# Altium project FD-KL-ASM-SUB-PCBA-MAIN.PrjPcb (part 1 of 2)
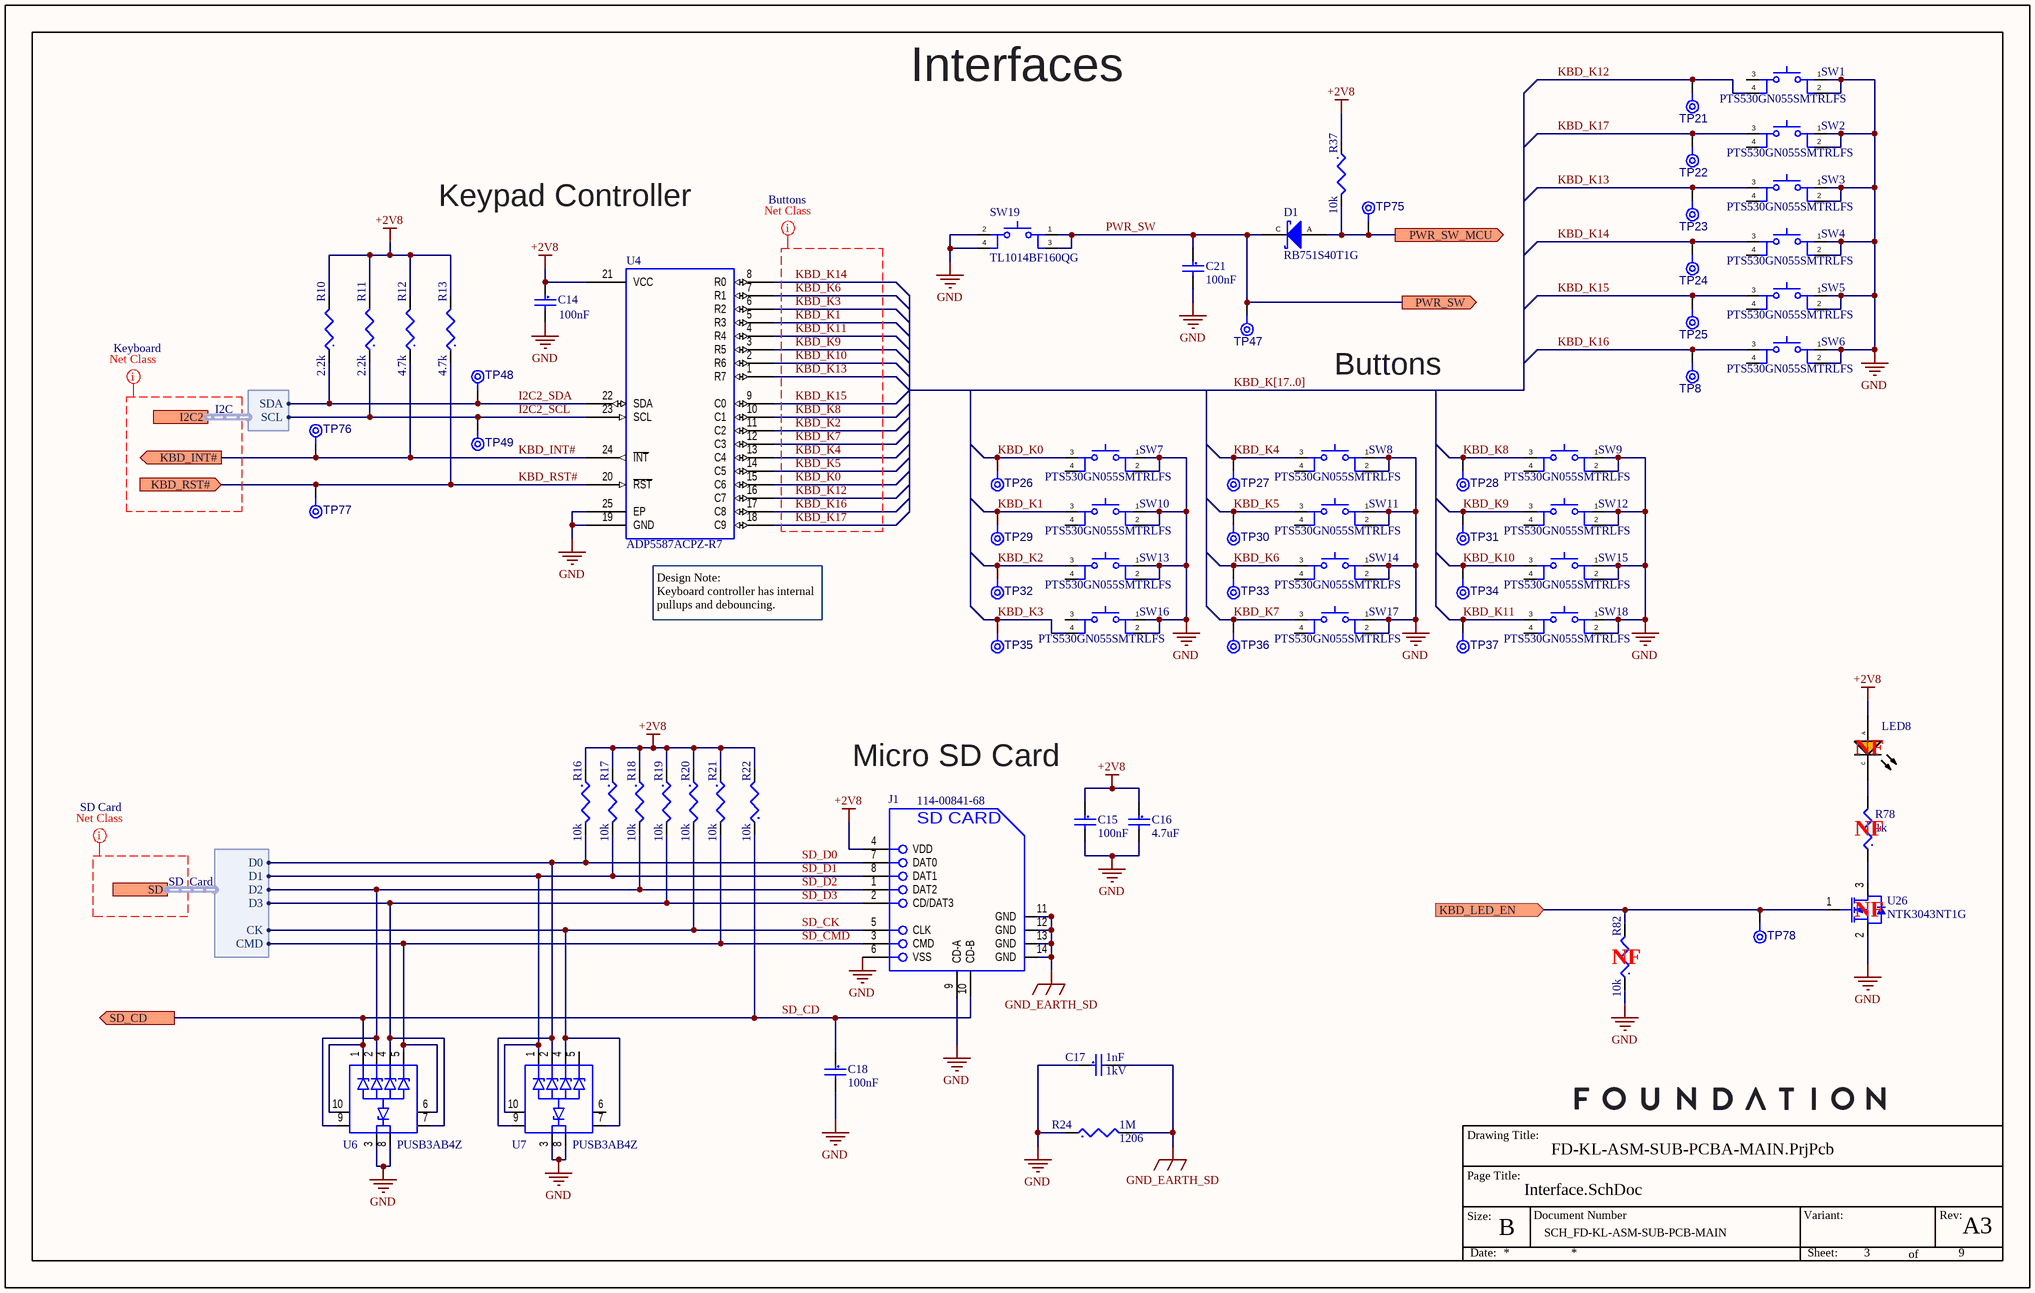
[diagram p0: Interface.SchDoc]
SCH_REV: A3; PCB_REV: A3; PCB_PART_NUMBER: FD-KL-ASM-SUB-PCB-MAIN; PCB_ENGINEER_APP_DATE: 12/11/2021; PCB_ENGINEER: M. Beach; PCB_DWG_NO: PCB-DWG_FD-KL-ASM-SUB-PCB-MAIN; PCB_DESIGNER_APP_DATE: 12/11/2021; PCB_DESIGNER: M. Beach; PCB_CHECKER_APP_DATE: 12/11/2021; PCB_CHECKER: M. Beach; PCB_ASSEMBLY_NO: PCB-ASSY_FD-KL-ASM-SUB-PCB-MAIN; PCB_ANG_TOL: +/-1/2; PCB_3_DEC_TOL: +/-.010; PCB_2_DEC_TOL: +/-.01; NotFitted: NF; DOC_NO_SCH_DWG: SCH_FD-KL-ASM-SUB-PCB-MAIN; DOC_NO_FAB_DWG: FAB_FD-KL-ASM-SUB-PCB-MAIN; DOC_NO_BOM: BOM_FD-KL-ASM-SUB-PCB-MAIN; DOC_NO_ASSY_DWG: ASSY_FD-KL-ASM-SUB-PCB-MAIN
5 sheets, 245 parts. Net scope: hierarchical (ports join the sheet entries above them; power ports are global).
Board file: FD-KL-ASM-SUB-PCBA-MAIN.PcbDoc
Sheets:
  Interface.SchDoc
  Camera.SchDoc
  LCD-Memory.SchDoc
  Power.SchDoc
  Charger.SchDoc

## Sheet Interface.SchDoc
size B; DocumentNumber: 3; SheetNumber: 3; SheetTotal: 9; ENG_APP_DATE: --/--/--; DSN_APP_DATE: --/--/--; CHK_APP_DATE: --/--/--

### Parts
C14  Capacitance: 100nF  [CAPC0402(1005)55_L]  (hidden comment: CAP CER 0.1uF 16V 10% X7R 0402)
C15  Capacitance: 100nF  [CAPC0402(1005)55_L]  (hidden comment: CAP CER 0.1uF 16V 10% X7R 0402)
C16  Capacitance: 4.7uF  [CAPC0402(1005)55_L]  (hidden comment: CAP CER 4.7UF 10V 20% X5R 0402)
C17  Capacitance: 1nF  Voltage Rating (DC): 1kV  [CAPC0805(2012)145_N]  (hidden comment: CAP CER 1000pF 1000V 10% X7R 0805)
C18  Capacitance: 100nF  [CAPC0402(1005)55_L]  (hidden comment: CAP CER 0.1uF 16V 10% X7R 0402)
C21  Capacitance: 100nF  [CAPC0402(1005)55_L]  (hidden comment: CAP CER 0.1uF 16V 10% X7R 0402)
D1  RB751S40T1G  [ON - SOD-523_V]
J1  114-00841-68  [AMPH - 114-00841-68_C-1]
LED8  IN-S63AT5A  [LEDC0603(1608)65_L]  (value not drawn)
R10  Resistance: 2.2k  [RESC0402(1005)_L]  (hidden comment: RES 2.2K 1/16W 1% 0402)
R11  Resistance: 2.2k  [RESC0402(1005)_L]  (hidden comment: RES 2.2K 1/16W 1% 0402)
R12  Resistance: 4.7k  [RESC0402(1005)_L]  (hidden comment: RES 4.7K 1/16W 1% 0402)
R13  Resistance: 4.7k  [RESC0402(1005)_L]  (hidden comment: RES 4.7K 1/16W 1% 0402)
R16  Resistance: 10k  [RESC0402(1005)_L]  (hidden comment: RES 10K 1/16W 1% 0402)
R17  Resistance: 10k  [RESC0402(1005)_L]  (hidden comment: RES 10K 1/16W 1% 0402)
R18  Resistance: 10k  [RESC0402(1005)_L]  (hidden comment: RES 10K 1/16W 1% 0402)
R19  Resistance: 10k  [RESC0402(1005)_L]  (hidden comment: RES 10K 1/16W 1% 0402)
R20  Resistance: 10k  [RESC0402(1005)_L]  (hidden comment: RES 10K 1/16W 1% 0402)
R21  Resistance: 10k  [RESC0402(1005)_L]  (hidden comment: RES 10K 1/16W 1% 0402)
R22  Resistance: 10k  [RESC0402(1005)_L]  (hidden comment: RES 10K 1/16W 1% 0402)
R24  Resistance: 1M  Case Code (Imperial): 1206  [RESC1206(3216)_L]  (hidden comment: RES 1.0M 1/4W 5% 1206)
R37  Resistance: 10k  [RESC0402(1005)_L]  (hidden comment: RES 10K 1/16W 1% 0402)
R78  Resistance: 1k  [RESC0402(1005)_L]  (hidden comment: RES 1.0K 1/16W 1% 0402)
R82  Resistance: 10k  [RESC0402(1005)_L]  (hidden comment: RES 10K 1/16W 1% 0402)
SW1  PTS530GN055SMTRLFS  [C&K - PTS530_V]
SW2  PTS530GN055SMTRLFS  [C&K - PTS530_V]
SW3  PTS530GN055SMTRLFS  [C&K - PTS530_V]
SW4  PTS530GN055SMTRLFS  [C&K - PTS530_V]
SW5  PTS530GN055SMTRLFS  [C&K - PTS530_V]
SW6  PTS530GN055SMTRLFS  [C&K - PTS530_V]
SW7  PTS530GN055SMTRLFS  [C&K - PTS530_V]
SW8  PTS530GN055SMTRLFS  [C&K - PTS530_V]
SW9  PTS530GN055SMTRLFS  [C&K - PTS530_V]
SW10  PTS530GN055SMTRLFS  [C&K - PTS530_V]
SW11  PTS530GN055SMTRLFS  [C&K - PTS530_V]
SW12  PTS530GN055SMTRLFS  [C&K - PTS530_V]
SW13  PTS530GN055SMTRLFS  [C&K - PTS530_V]
SW14  PTS530GN055SMTRLFS  [C&K - PTS530_V]
SW15  PTS530GN055SMTRLFS  [C&K - PTS530_V]
SW16  PTS530GN055SMTRLFS  [C&K - PTS530_V]
SW17  PTS530GN055SMTRLFS  [C&K - PTS530_V]
SW18  PTS530GN055SMTRLFS  [C&K - PTS530_V]
SW19  TL1014BF160QG  [E-SWITCH - TL1014BFXXXQG]
TP8  TPAD8R  [TP08R]  (value not drawn)  (no BOM)
TP21  TPAD8R  [TP08R]  (value not drawn)  (no BOM)
TP22  TPAD8R  [TP08R]  (value not drawn)  (no BOM)
TP23  TPAD8R  [TP08R]  (value not drawn)  (no BOM)
TP24  TPAD8R  [TP08R]  (value not drawn)  (no BOM)
TP25  TPAD8R  [TP08R]  (value not drawn)  (no BOM)
TP26  TPAD8R  [TP08R]  (value not drawn)  (no BOM)
TP27  TPAD8R  [TP08R]  (value not drawn)  (no BOM)
TP28  TPAD8R  [TP08R]  (value not drawn)  (no BOM)
TP29  TPAD8R  [TP08R]  (value not drawn)  (no BOM)
TP30  TPAD8R  [TP08R]  (value not drawn)  (no BOM)
TP31  TPAD8R  [TP08R]  (value not drawn)  (no BOM)
TP32  TPAD8R  [TP08R]  (value not drawn)  (no BOM)
TP33  TPAD8R  [TP08R]  (value not drawn)  (no BOM)
TP34  TPAD8R  [TP08R]  (value not drawn)  (no BOM)
TP35  TPAD8R  [TP08R]  (value not drawn)  (no BOM)
TP36  TPAD8R  [TP08R]  (value not drawn)  (no BOM)
TP37  TPAD8R  [TP08R]  (value not drawn)  (no BOM)
TP47  TPAD8R  [TP08R]  (value not drawn)  (no BOM)
TP48  TPAD8R  [TP08R]  (value not drawn)  (no BOM)
TP49  TPAD8R  [TP08R]  (value not drawn)  (no BOM)
TP75  TPAD8R  [TP08R]  (value not drawn)  (no BOM)
TP76  TPAD8R  [TP08R]  (value not drawn)  (no BOM)
TP77  TPAD8R  [TP08R]  (value not drawn)  (no BOM)
TP78  TPAD8R  [TP08R]  (value not drawn)  (no BOM)
U4  ADP5587ACPZ-R7  [ADEV - LFCSP-24_L]
U6  PUSB3AB4Z  [NEXP - DFN2510A-10_L]
U7  PUSB3AB4Z  [NEXP - DFN2510A-10_L]
U26  NTK3043NT1G  [SOT-723-3(40)_N]

### Ports
I2C2 (harness I2C), KBD_INT# (out), KBD_LED_EN (in), KBD_RST# (in), PWR_SW (out), PWR_SW_MCU (out), SD (harness SD_Card), SD_CD (out)

### Harnesses
SD_Card: CK, CMD, D0, D1, D2, D3
I2C: SCL, SDA

### Nets
+2V8: C14.1 C15.1 C16.1 J1.4(VDD) LED8.A R10.2 R11.2 R12.2 R13.2 R16.1 R17.1 R18.1 R19.1 R20.1 R21.1 R22.2 R37.1 U4.21(VCC)
GND: C14.2 C15.2 C16.2 C17.1 C18.2 C21.2 J1.6(VSS) J1.9(CD-A) R24.1 R82.1 SW1.1 SW1.2 SW2.1 SW2.2 SW3.1 SW3.2 SW4.1 SW4.2 SW5.1 SW5.2 SW6.1 SW6.2 SW7.1 SW7.2 SW8.1 SW8.2 SW9.1 SW9.2 SW10.1 SW10.2 SW11.1 SW11.2 SW12.1 SW12.2 SW13.1 SW13.2 SW14.1 SW14.2 SW15.1 SW15.2 SW16.1 SW16.2 SW17.1 SW17.2 SW18.1 SW18.2 SW19.2 SW19.4 U4.19(GND) U4.25(EP) U6.3(DIODE) U6.8(DIODE) U7.3(DIODE) U7.8(DIODE) U26.2(S)
GND_EARTH_SD: C17.2 J1.11(GND) J1.12(GND) J1.13(GND) J1.14(GND) R24.2
I2C2_SCL: R11.1 TP49.1(TP) U4.23(SCL) ; port I2C2.SCL
I2C2_SDA: R10.1 TP48.1(TP) U4.22(SDA) ; port I2C2.SDA
KBD_INT#: R12.1 TP76.1(TP) U4.24(~{INT}) ; port KBD_INT#
KBD_K0: SW7.3 TP26.1(TP) U4.15(C6)
KBD_K1: SW10.3 TP29.1(TP) U4.5(R3)
KBD_K2: SW13.3 TP32.1(TP) U4.11(C2)
KBD_K3: SW16.4 TP35.1(TP) U4.6(R2)
KBD_K4: SW8.3 TP27.1(TP) U4.13(C4)
KBD_K5: SW11.3 TP30.1(TP) U4.14(C5)
KBD_K6: SW14.3 TP33.1(TP) U4.7(R1)
KBD_K7: SW17.3 TP36.1(TP) U4.12(C3)
KBD_K8: SW9.3 TP28.1(TP) U4.10(C1)
KBD_K9: SW12.3 TP31.1(TP) U4.3(R5)
KBD_K10: SW15.3 TP34.1(TP) U4.2(R6)
KBD_K11: SW18.3 TP37.1(TP) U4.4(R4)
KBD_K12: SW1.4 TP21.1(TP) U4.16(C7)
KBD_K13: SW3.3 TP23.1(TP) U4.1(R7)
KBD_K14: SW4.3 TP24.1(TP) U4.8(R0)
KBD_K15: SW5.3 TP25.1(TP) U4.9(C0)
KBD_K16: SW6.3 TP8.1(TP) U4.17(C8)
KBD_K17: SW2.3 TP22.1(TP) U4.18(C9)
KBD_RST#: R13.1 TP77.1(TP) U4.20(~{RST}) ; port KBD_RST#
PWR_SW: C21.1 D1.C SW19.1 SW19.3 TP47.1(TP) ; port PWR_SW
SD_CD: C18.1 J1.10(CD-B) R22.1 U6.1(DIODE) U6.10(DIODE) ; port SD_CD
SD_CK: J1.5(CLK) R20.2 U7.4(DIODE) U7.7(DIODE) ; port SD.CK
SD_CMD: J1.3(CMD) R21.2 U6.5(DIODE) U6.6(DIODE) ; port SD.CMD
SD_D0: J1.7(DAT0) R16.2 U7.2(A) U7.9(DIODE) ; port SD.D0
SD_D1: J1.8(DAT1) R17.2 U7.1(DIODE) U7.10(DIODE) ; port SD.D1
SD_D2: J1.1(DAT2) R18.2 U6.2(A) U6.9(DIODE) ; port SD.D2
SD_D3: J1.2(CD/DAT3) R19.2 U6.4(DIODE) U6.7(DIODE) ; port SD.D3
NetD1_A: D1.A R37.2 TP75.1(TP) ; port PWR_SW_MCU
NetLED8_C: LED8.C R78.2
NetR78_1: R78.1 U26.3(D)
NetR82_2: R82.2 TP78.1(TP) U26.1(G) ; port KBD_LED_EN

Not connected (* = marked no-connect by the designer): SW1 3; SW2 4; SW3 4; SW4 4; SW5 4; SW6 4; SW7 4; SW8 4; SW9 4; SW10 4; SW11 4; SW12 4; SW13 4; SW14 4; SW15 4; SW16 3; SW17 4; SW18 4; U7 5(DIODE) 6(DIODE)

### Buses and harness runs
bus KBD_K[17..0]

### Layout directives
net class Keyboard: (no net found under the mark)
net class SD Card: (no net found under the mark)
net class Buttons: KBD_K0, KBD_K1, KBD_K2, KBD_K3, KBD_K4, KBD_K5, KBD_K6, KBD_K7, KBD_K8, KBD_K9, KBD_K10, KBD_K11, KBD_K12, KBD_K13, KBD_K14, KBD_K15, KBD_K16, KBD_K17

### Notes on the sheet
- Interfaces
- Keypad Controller
- Buttons
- (near U4) Design Note:
  Keyboard controller has internal pullups and debouncing.
- Micro SD Card
- Drawing Title:
- Page Title:
- Size:
- B
- Document Number
- Variant:
- Rev:
- Date:
- Sheet:
- of
- (in symbol CMP-CON-0078-2) SD CARD

### Library data of the parts
C14 C15 C18 C21 = CMP-CAP-00002-2: 0.1µF ±10% 16V Ceramic Capacitor X7R 0402 (1005 Metric); Insulation Resistance: 10GR; Material: Ceramic; Tolerance: 10%; REACH SVHC: No SVHC; Radiation Hardening: No; Case Code (Metric): 1005; Height: 0.5mm; Depth: 0.5mm; Min Operating Temperature: -55°C; Max Operating Temperature: 125°C; Lead Free: Lead Free; Thickness: 0.022inch; Length: 1mm; Voltage Rating (DC): 16V; Dielectric Material: Ceramic; Packaging: Tape and Reel; Case/Package: 0402; Width: 0.5mm; Termination: SMD/SMT; Voltage Rating: 16V; Mount: Surface Mount; Case Code (Imperial): 0402; Package Quantity: 1; Dielectric: X7R; Number of Pins: 2; Voltage: 16V
C16 = CMP-CAP-00038-1: 4.7µF ±20% 10V Ceramic Capacitor X5R 0402 (1005 Metric); Length: 1mm; Termination: SMD/SMT; Max Operating Temperature: 85°C; Case Code (Imperial): 0402; Height: 0.5mm; Voltage Rating: 10V; Composition: Ceramic; Dielectric: X5R; Voltage Rating (DC): 10V; REACH SVHC: No SVHC; Case Code (Metric): 1005; Tolerance: 20%; Case/Package: 0402; Min Operating Temperature: -55°C; Width: 0.02inch; Mount: Surface Mount; Packaging: Tape and Reel; Package Quantity: 1; Thickness: 500um; Radiation Hardening: No; Voltage: 10V; Depth: 0.5mm; Weight: 2.3E-05oz; Dielectric Material: Ceramic; Lead Free: Lead Free
C17 = CMP-CAP-00004-1: 1000pF ±10% 1000V (1kV) Ceramic Capacitor X7R 0805 (2012 Metric); Insulation Resistance: 100GR; Mount: Surface Mount; Width: 1.25mm; Voltage Rating: 1kV; Number of Pins: 2; Packaging: Tape and Reel; Package Quantity: 4000; Termination: SMD/SMT; Height: 1.3mm; Case Code (Metric): 2012; Depth: 1.25mm; Dielectric: X7R; Thickness: 0.051inch; Length: 2.01mm; Case Code (Imperial): 0805; Contact Plating: Nickel,Tin,Matte; Dissipation Factor: 10%; Tolerance: 10%; Case/Package: 0805; Min Operating Temperature: -55°C; REACH SVHC: No SVHC; Lead Free: Lead Free; Dielectric Material: Ceramic; Max Operating Temperature: 125°C
D1 = CMP-DIO-0007-1: Diode Schottky 30V 30mA (DC) Surface Mount SOD-523; Voltage Rating (DC): 40V; Peak Non-Repetitive Surge Current: 500mA; Peak Reverse Current: 500nA; Element Configuration: Single; Capacitance: 2.5pF; Power Dissipation: 200mW; Polarity: Standard; Forward Voltage: 370mV; Radiation Hardening: No; Min Operating Temperature: -55°C; Current Rating: 30mA; Forward Current: 30mA; Number of Pins: 2; Average Rectified Current: 30mA; Output Current: 30mA; Max Operating Temperature: 150°C; Width: 0.9mm; ComponentLink1Description: Datasheet; Length: 1.3mm; Max Surge Current: 500mA; Max Reverse Voltage (DC): 30V; REACH SVHC: No SVHC; Lead Free: Lead Free; Max Reverse Leakage Current: 500nA; Max Forward Surge Current (Ifsm): 500mA; Package Quantity: 1; ComponentLink1URL: https://www.onsemi.cn/PowerSolutions/document/RB751S40T1-D.PDF; Max Repetitive Reverse Voltage (Vrrm): 40V; Contact Plating: Tin,Matte; Case/Package: SOD-523-2; Height: 0.7mm; Packaging: Tape and Reel
J1 = CMP-CON-0078-2: 10 (8 + 2) Position Card Connector Secure Digital - microSD™ Surface Mount, Right Angle Gold; ComponentLink1URL: https://media.digikey.com/pdf/Data%20Sheets/Amphenol%20PDFs/114-00841-68.pdf; ComponentLink1Description: Drawing
LED8 = CMP-007-00047-1: Amber 605nm LED Indication - Discrete 1.9V 0603 (1608 Metric); Forward Voltage: 1.9V; Colour: Amber; ComponentLink1Description: Datasheet; ComponentLink1URL: http://www.inolux-corp.com/datasheet/SMDLED/Mono%20Color%20Top%20View/IN-S63AT%20Series_V1.1.pdf
R10 R11 = CMP-RES-00049-1: 2.2 kOhms ±1% 0.063W, 1/16W Chip Resistor 0402 (1005 Metric); Power Rating: 63mW; Temperature Coefficient: 100ppm/°C; Voltage Rating: 50V; Weight: 2.3E-05oz; Military Standard: Not; Termination: SMD/SMT; Max Operating Temperature: 155°C; Case Code (Metric): 1005; Case Code (Imperial): 0402; REACH SVHC: Unknown; Min Operating Temperature: -55°C; Tolerance: 1%; Width: 0.5mm; Depth: 0.5mm; Length: 1mm; Case/Package: 0402; Height: 0.35mm; Packaging: Tape and Reel; Lead Free: Lead Free; Composition: Thick Film
R12 R13 = CMP-RES-00002-3: 4.7 kOhms ±1% 0.063W, 1/16W Chip Resistor 0402 (1005 Metric) Automotive AEC-Q200 Thick Film; Max Power Dissipation: 63mW; Voltage Rating (DC): 50V; Temperature Coefficient: 100ppm/°C; Weight: 2.3E-05oz; Package Quantity: 10; Military Standard: Not; Contact Plating: Tin; Termination: SMD/SMT; Max Operating Temperature: 155°C; Case Code (Metric): 1005; Case Code (Imperial): 0402; Features: Automotive AEC-Q200; Power Rating: 63mW; REACH SVHC: Unknown; Min Operating Temperature: -55°C; Tolerance: 1%; Mount: Surface Mount; Width: 0.5mm; Depth: 0.5mm; Radiation Hardening: No; Length: 1mm; Number of Terminations: 2; Case/Package: 0402; Voltage Rating: 50V; Height: 0.35mm; Packaging: Tape and Reel; Lead Free: Lead Free; Composition: Thick Film
R16-R21 R37 = CMP-RES-00006-3: 10 kOhms ±1% 0.063W, 1/16W Chip Resistor 0402 (1005 Metric); Voltage Rating (DC): 50V; Power Rating: 63mW; Temperature Coefficient: 100ppm/°C; Case Code (Imperial): 0402; Mount: Surface Mount; Composition: Thick Film; Features: Automotive AEC-Q200; Depth: 0.5mm; Height: 0.35mm; Weight: 2.3E-05oz; Number of Pins: 2; Termination: SMD/SMT; Min Operating Temperature: -55°C; Length: 1mm; Package Quantity: 10; Lead Free: Lead Free; Radiation Hardening: No; Max Operating Temperature: 155°C; Voltage Rating: 50V; Military Standard: Not; Case/Package: 0402; Contact Plating: Tin; Max Power Dissipation: 63mW; Tolerance: 1%; Case Code (Metric): 1005; Number of Terminations: 2; Packaging: Tape and Reel; REACH SVHC: Unknown; Width: 0.02inch
R22 R82 = CMP-RES-00006-3: 10 kOhms ±1% 0.063W, 1/16W Chip Resistor 0402 (1005 Metric); Max Power Dissipation: 63mW; Voltage Rating (DC): 50V; Temperature Coefficient: 100ppm/°C; Width: 0.02inch; Power Rating: 63mW; Case/Package: 0402; Min Operating Temperature: -55°C; Number of Terminations: 2; Lead Free: Lead Free; Features: Automotive AEC-Q200; Number of Pins: 2; Tolerance: 1%; Height: 0.35mm; Mount: Surface Mount; Radiation Hardening: No; Length: 1mm; Case Code (Metric): 1005; Weight: 2.3E-05oz; Military Standard: Not; Depth: 0.5mm; Package Quantity: 10; Max Operating Temperature: 155°C; Termination: SMD/SMT; Case Code (Imperial): 0402; Contact Plating: Tin; Voltage Rating: 50V; Composition: Thick Film; Packaging: Tape and Reel; REACH SVHC: Unknown
R24 = CMP-RES-00004-3: 1 MOhms ±5% 0.25W, 1/4W Chip Resistor 1206 (3216 Metric) Moisture Resistant Thick Film; Power Rating: 250mW; Temperature Coefficient: 200ppm/°C; Voltage Rating: 200V; Mount: Surface Mount; Radiation Hardening: No; Tolerance: 5%; Military Standard: Not; Termination: SMD/SMT; Case Code (Metric): 3216; Depth: 1.6mm; Case/Package: 1206; REACH SVHC: No SVHC; Height: 0.6mm; Max Operating Temperature: 155°C; Package Quantity: 5000; Thickness: 610um; Min Operating Temperature: -55°C; Voltage Rating (DC): 200V; Length: 3.2mm; Composition: Thick Film; Width: 1.6mm; Packaging: Tape and Reel; Contact Plating: Tin
R78 = CMP-RES-00000-3: 1 kOhms ±0.5% 0.063W, 1/16W Chip Resistor 0402 (1005 Metric) Automotive AEC-Q200 Thin Film; Max Power Dissipation: 63mW; Power Rating: 62.5mW; Voltage Rating (DC): 25V; Temperature Coefficient: 25ppm/°C; Width: 0.5mm; Case/Package: 0402; Min Operating Temperature: -55°C; Number of Terminations: 2; Lead Free: Lead Free; Tolerance: 0.5%; Height: 0.016inch; Mount: Surface Mount; Radiation Hardening: No; Length: 1mm; Case Code (Metric): 1005; Weight: 2.8E-05oz; Military Standard: Not; Depth: 0.5mm; Package Quantity: 10000; Max Operating Temperature: 155°C; Termination: SMD/SMT; Case Code (Imperial): 0402; Contact Plating: Tin; Voltage Rating: 25V; Composition: Metal Film,Thin Film; Packaging: Tape and Reel; REACH SVHC: No SVHC
SW1-SW18 = CMP-SWH-00003-1: Tactile Switch SPST-NO Top Actuated Surface Mount; Manufacturer Series: PTS530; Contact DC Max Rating R Load: 0.05A@12VDC; Dielectric Withstand Volts: 250VACV; Body Height: 0.5588mm; Switch Action: MOMENTARY; Contact Voltage(DC)-Max: 12V; Actuator Travel: 0.2032mm; Electrical Life: 1000000Cycles; Body Length or Diameter: 4.4958mm; Switch Type: Keypad; Contact Current(DC)-Max: 50mA; Actuator Type: Pushbutton; Contact Resistance: 0.05mR; Insulation Resistance: 100MR; Body Breadth: 4.4958inch; Switch Function: SPST; Min Operating Temperature: -40°C; Max Operating Temperature: 85°C; RoHS Compliant: Yes; Mount: Surface Mount; ComponentLink1URL: https://www.ckswitches.com/media/1469/pts530.pdf; Termination: Solder; ComponentLink1Description: Datasheet; REACH SVHC: Yes; JESD-609 Code: e4; Terminal Finish: Silver
SW19 = CMP-SWH-00004-1: Tactile Switch SPST-NO Side Actuated Surface Mount, Right Angle; Switch Type: Keypad; ComponentLink1Description: Drawing; ComponentLink1URL: http://spec_sheets.e-switch.com/specs/P410002.pdf; JESD-609 Code: e4; REACH SVHC: Yes; Terminal Finish: Silver; RoHS Compliant: Yes
TP8 TP21-TP37 TP47-TP49 TP75-TP78 = CMP-MECH-00011-2: 0.8mm round; Pins: 1
U4 = CMP-IC-INT-0000-10: I/O Expander 18 I²C 400kHz 24-LFCSP-WQ (4x4); Max Supply Voltage: 3.6V; Number of I/Os: 18; Nominal Supply Current: 200uA; Min Supply Voltage: 1.65V; Interface: I2C; Number of Pins: 24; REACH SVHC: No SVHC; Case/Package: 24-LFCSP-WQ (4x4); Max Operating Temperature: 85°C; Package Quantity: 1500; Min Operating Temperature: -40°C; Frequency: 400kHz; Packaging: Tape and Reel; Mount: Surface Mount; Lead Free: Contains Lead; Max Frequency: 400kHz; ComponentLink1URL: https://www.analog.com/media/en/technical-documentation/data-sheets/ADP5587.pdf; ComponentLink1Description: Datasheet; Max Supply Current: 200uA
U6 U7 = CMP-DIO-0006-4: TVS DIODE 3.3V 5V DFN2510A-10; Capacitance @ Frequency: 0.17pF @ 1MHz; Bidirectional Channels: 4; Type: Zener; Max Operating Temperature: 85°C; Min Operating Temperature: -40°C; Case/Package: DFN2510A-10; ComponentLink1Description: Datasheet; ComponentLink1URL: https://assets.nexperia.com/documents/data-sheet/PUSB3AB4.pdf
U26 = CMP-TRNST-0003-1: N-Channel 20V 210mA (Ta) 310mW (Ta) Surface Mount SOT-723; Power Dissipation: 440mW; Gate to Source Voltage (Vgs): 10V; Drain to Source Resistance: 3.4R; Input Capacitance: 11pF; Turn-On Delay Time: 13ns; Vgs(th) (Max) @ Id: 1.3V @ 250µA; Turn-Off Delay Time: 94ns; Rise Time: 15ns; Number of Elements: 1; Element Configuration: Single; Current Rating: 225mA; Threshold Voltage: 400mV; Max Operating Temperature: 150°C; Package Quantity: 1; Packaging: Tape and Reel; Continuous Drain Current (ID): 210mA; Pins: 3; Min Operating Temperature: -55°C; Vgs (Max): 10V; Drain to Source Breakdown Voltage: 20V; Radiation Hardening: No; Mounting Technology: Surface Mount; Drain to Source Voltage (Vdss): 20V; Number of Pins: 3; Max Power Dissipation: 310mW; Fall Time: 15ns; Case/Package: SOT-723-3; Transistor Type: N-Channel; Rds On Max: 3.4R; Lead Free: Lead Free; Height: 0.55mm; Contact Plating: Tin,Matte; On-State Resistance: 3.4R; Length: 1.25mm; REACH SVHC: No SVHC; Width: 0.85mm; Voltage Rating (DC): 20V

## Sheet Camera.SchDoc
size B; DocumentNumber: 4; SheetNumber: 4; SheetTotal: 9; ENG_APP_DATE: --/--/--; DSN_APP_DATE: --/--/--; CHK_APP_DATE: --/--/--
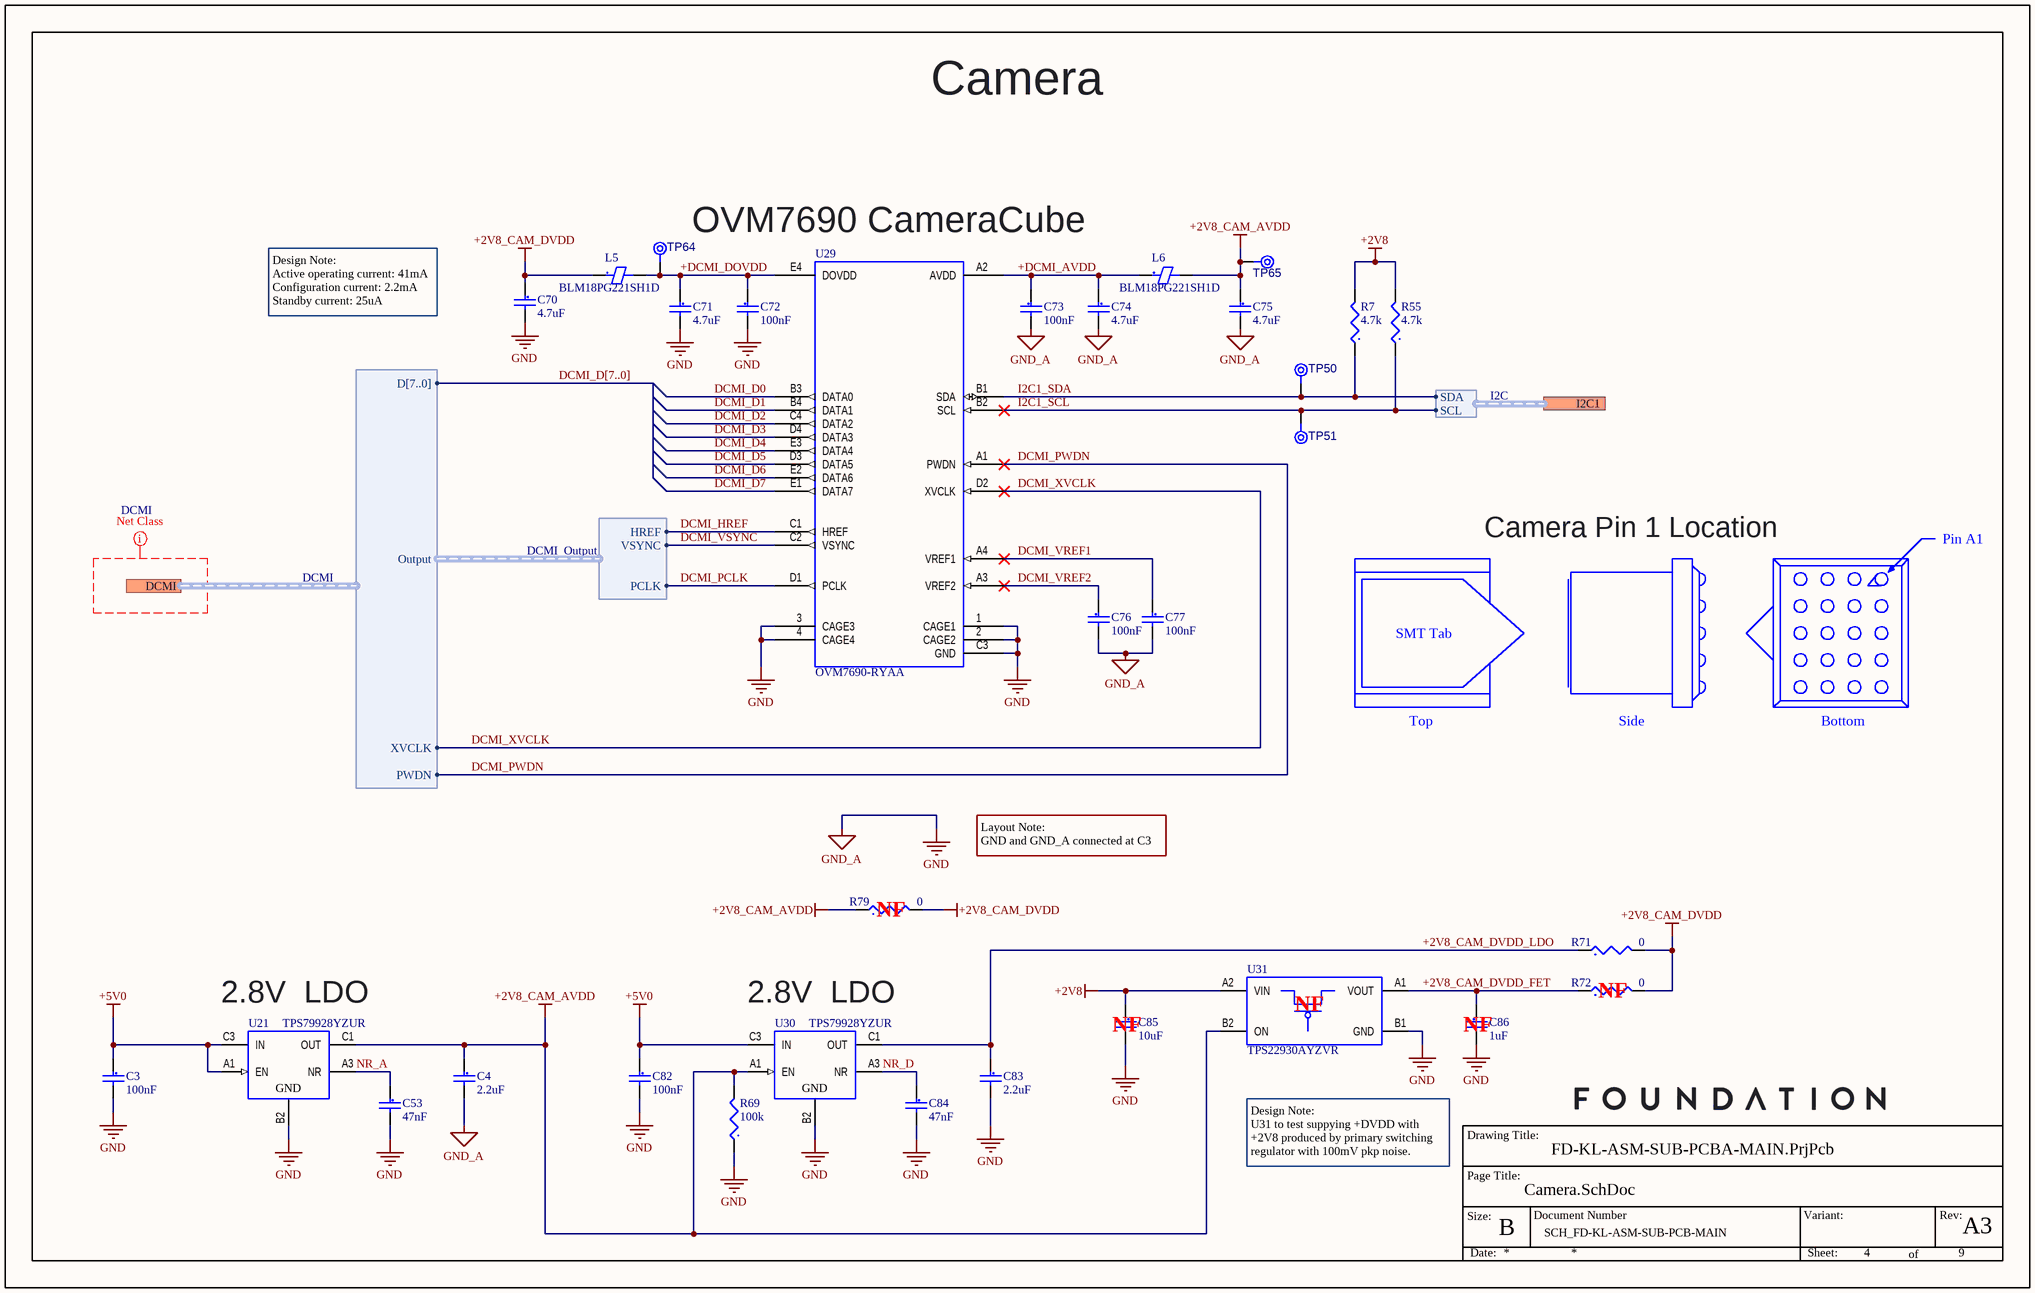
[diagram p1: Camera.SchDoc]

### Parts
C3  Capacitance: 100nF  [CAPC0402(1005)55_L]  (hidden comment: CAP CER 0.1uF 16V 10% X7R 0402)
C4  Capacitance: 2.2uF  [CAPC0402(1005)55_L]  (hidden comment: CAP CER 2.2uF 6.3V 10% X5R 0402)
C53  Capacitance: 47nF  [CAPC0402(1005)55_L]  (hidden comment: CAP CER 0.047uF 10V 10% X7R 0402)
C70  Capacitance: 4.7uF  [CAPC0402(1005)55_L]  (hidden comment: CAP CER 4.7UF 10V 20% X5R 0402)
C71  Capacitance: 4.7uF  [CAPC0402(1005)55_L]  (hidden comment: CAP CER 4.7UF 10V 20% X5R 0402)
C72  Capacitance: 100nF  [CAPC0402(1005)55_L]  (hidden comment: CAP CER 0.1uF 16V 10% X7R 0402)
C73  Capacitance: 100nF  [CAPC0402(1005)55_L]  (hidden comment: CAP CER 0.1uF 16V 10% X7R 0402)
C74  Capacitance: 4.7uF  [CAPC0402(1005)55_L]  (hidden comment: CAP CER 4.7UF 10V 20% X5R 0402)
C75  Capacitance: 4.7uF  [CAPC0402(1005)55_L]  (hidden comment: CAP CER 4.7UF 10V 20% X5R 0402)
C76  Capacitance: 100nF  [CAPC0402(1005)55_L]  (hidden comment: CAP CER 0.1uF 16V 10% X7R 0402)
C77  Capacitance: 100nF  [CAPC0402(1005)55_L]  (hidden comment: CAP CER 0.1uF 16V 10% X7R 0402)
C82  Capacitance: 100nF  [CAPC0402(1005)55_L]  (hidden comment: CAP CER 0.1uF 16V 10% X7R 0402)
C83  Capacitance: 2.2uF  [CAPC0402(1005)55_L]  (hidden comment: CAP CER 2.2uF 6.3V 10% X5R 0402)
C84  Capacitance: 47nF  [CAPC0402(1005)55_L]  (hidden comment: CAP CER 0.047uF 10V 10% X7R 0402)
C85  Capacitance: 10uF  [CAPC0402(1005)55_L]  (hidden comment: CAP CER 10uF 10V 20% X5R 0402)
C86  Capacitance: 1uF  [CAPC0402(1005)55_L]  (hidden comment: CAP CER 1uF 25V 10% X5R 0402)
L5  BLM18PG221SH1D  [FBC0603(1608)90_L]
L6  BLM18PG221SH1D  [FBC0603(1608)90_L]
R7  Resistance: 4.7k  [RESC0402(1005)_L]  (hidden comment: RES 4.7K 1/16W 1% 0402)
R55  Resistance: 4.7k  [RESC0402(1005)_L]  (hidden comment: RES 4.7K 1/16W 1% 0402)
R69  Resistance: 100k  [RESC0402(1005)_L]  (hidden comment: RES 100K 1/16W 1% 0402)
R71  Resistance: 0  [RESC0603(1608)_L]  (hidden comment: RES 0 OHM JUMPER 1/10W 0603)
R72  Resistance: 0  [RESC0603(1608)_L]  (hidden comment: RES 0 OHM JUMPER 1/10W 0603)
R79  Resistance: 0  [RESC0603(1608)_L]  (hidden comment: RES 0 OHM JUMPER 1/10W 0603)
TP50  TPAD8R  [TP08R]  (value not drawn)  (no BOM)
TP51  TPAD8R  [TP08R]  (value not drawn)  (no BOM)
TP64  TPAD8R  [TP08R]  (value not drawn)  (no BOM)
TP65  TPAD8R  [TP08R]  (value not drawn)  (no BOM)
U21  TPS79928YZUR  [TI - DSBGA-YZU-5_V]
U29  OVM7690-RYAA  [OMNI - CCBGA-CG-20]
U30  TPS79928YZUR  [TI - DSBGA-YZU-5_V]
U31  TPS22930AYZVR  [TI - DSBGA-YZV-4_V]

### Ports
DCMI (harness DCMI), I2C1 (harness I2C)

### Harnesses
I2C: SCL, SDA
DCMI: Output, D[7..0], XVCLK, PWDN
DCMI_Output: HREF, VSYNC, PCLK

### Nets
+2V8: C85.1 R7.2 R55.2 U31.A2(VIN)
+2V8_CAM_AVDD: C4.1 C75.1 L6.2 R69.2 R79.1 TP65.1(TP) U21.C1(OUT) U30.A1(EN) U31.B2(ON)
+2V8_CAM_DVDD: C70.1 L5.1 R71.2 R72.2 R79.2
+5V0: C3.1 C82.1 U21.A1(EN) U21.C3(IN) U30.C3(IN)
GND: C3.2 C4.2 C53.2 C70.2 C71.2 C72.2 C73.2 C74.2 C75.2 C76.2 C77.2 C82.2 C83.2 C84.2 C85.2 C86.2 R69.1 U21.B2(GND) U29.1(CAGE1) U29.2(CAGE2) U29.3(CAGE3) U29.4(CAGE4) U29.C3(GND) U30.B2(GND) U31.B1(GND)  [also labelled GND_A]
+2V8_CAM_DVDD_FET: C86.1 R72.1 U31.A1(VOUT)
+2V8_CAM_DVDD_LDO: C83.1 R71.1 U30.C1(OUT)
+DCMI_AVDD: C73.1 C74.1 L6.1 U29.A2(AVDD)
+DCMI_DOVDD: C71.1 C72.1 L5.2 TP64.1(TP) U29.E4(DOVDD)
DCMI_D0: U29.B3(DATA0)
DCMI_D1: U29.B4(DATA1)
DCMI_D2: U29.C4(DATA2)
DCMI_D3: U29.D4(DATA3)
DCMI_D4: U29.E3(DATA4)
DCMI_D5: U29.D3(DATA5)
DCMI_D6: U29.E2(DATA6)
DCMI_D7: U29.E1(DATA7)
DCMI_HREF: U29.C1(HREF) ; harness DCMI_Output.HREF
DCMI_PCLK: U29.D1(PCLK) ; harness DCMI_Output.PCLK
DCMI_PWDN: U29.A1(PWDN) ; port DCMI.PWDN
DCMI_VREF1: C77.1 U29.A4(VREF1)
DCMI_VREF2: C76.1 U29.A3(VREF2)
DCMI_VSYNC: U29.C2(VSYNC) ; harness DCMI_Output.VSYNC
DCMI_XVCLK: U29.D2(XVCLK) ; port DCMI.XVCLK
I2C1_SCL: R55.1 TP51.1(TP) U29.B2(SCL) ; port I2C1.SCL
I2C1_SDA: R7.1 TP50.1(TP) U29.B1(SDA) ; port I2C1.SDA
NR_A: C53.1 U21.A3(NR)
NR_D: C84.1 U30.A3(NR)

### Buses and harness runs
bus DCMI_D[7..0]

### Layout directives
net class DCMI: (no net found under the mark)

### Notes on the sheet
- Camera
- (near U29) OVM7690 CameraCube
- Design Note:
  Active operating current: 41mA
  Configuration current: 2.2mA
  Standby current: 25uA
- Camera Pin 1 Location
- Pin A1
- SMT Tab
- Top
- Side
- Bottom
- Layout Note:
  GND and GND_A connected at C3
- (near U21) 2.8V  LDO
- (near U30) 2.8V  LDO
- Design Note:
  U31 to test suppying +DVDD with +2V8 produced by primary switching regulator with 100mV pkp noise.
- Drawing Title:
- Page Title:
- Size:
- B
- Document Number
- Variant:
- Rev:
- Date:
- Sheet:
- of

### Library data of the parts
C3 C72 C73 C76 C77 C82 = CMP-CAP-00002-2: as C14 on sheet Interface; Material: Ceramic; Tolerance: 10%; REACH SVHC: No SVHC; Radiation Hardening: No; Case Code (Metric): 1005; Height: 0.5mm; Depth: 0.5mm; Min Operating Temperature: -55°C; Max Operating Temperature: 125°C; Lead Free: Lead Free; Thickness: 0.022inch; Length: 1mm; Voltage Rating (DC): 16V; Dielectric Material: Ceramic; Packaging: Tape and Reel; Case/Package: 0402; Width: 0.5mm; Termination: SMD/SMT; Voltage Rating: 16V; Mount: Surface Mount; Case Code (Imperial): 0402; Package Quantity: 1; Dielectric: X7R; Number of Pins: 2; Voltage: 16V
C4 C83 = CMP-CAP-00042-1: 2.2µF ±10% 6.3V Ceramic Capacitor X5R 0402 (1005 Metric); Lead Free: Lead Free; Tolerance: 10%; Width: 0.02inch; Number of Pins: 2; Contact Plating: Tin,Matte; Max Operating Temperature: 85°C; Termination: SMD/SMT; Voltage Rating: 6.3V; Thickness: 0.022inch; Case Code (Imperial): 0402; Case Code (Metric): 1005; Radiation Hardening: No; Package Quantity: 1; Mount: Surface Mount; Length: 1mm; Case/Package: 0402; REACH SVHC: No SVHC; Packaging: Tape and Reel; Min Operating Temperature: -55°C; Dielectric: X5R; Depth: 0.5mm; Voltage Rating (DC): 6.3V
C53 C84 = CMP-CAP-00056-1: 0.047µF ±10% 10V Ceramic Capacitor X7R 0402 (1005 Metric); Number of Terminals/Pins: 2; Multilayer: Yes; Height: 0.5mm; Package Shape: Rectangular; Positive Tolerance: 10%; Max Operating Temperature: 125°C; Termination: Wraparound; Capacitor Type: Ceramic; Width: 0.5mm; Negative Tolerance: 10%; Rated DC Voltage (URdc): 10V; Length: 1mm; Mount: Surface Mount; Size Code: 0402; JESD-609 Code: e3; Temperature Characteristics Code: X7R; Min Operating Temperature: -55°C; Terminal Finish: Nickel; Package Style: SMTMeter; Packaging: Tape and Reel; Dielectric Material: Ceramic
C70 C71 C74 C75 = CMP-CAP-00038-1: as C16 on sheet Interface; Length: 1mm; Termination: SMD/SMT; Max Operating Temperature: 85°C; Case Code (Imperial): 0402; Height: 0.5mm; Voltage Rating: 10V; Composition: Ceramic; Dielectric: X5R; Voltage Rating (DC): 10V; REACH SVHC: No SVHC; Case Code (Metric): 1005; Tolerance: 20%; Case/Package: 0402; Min Operating Temperature: -55°C; Width: 0.02inch; Mount: Surface Mount; Packaging: Tape and Reel; Package Quantity: 1; Thickness: 500um; Radiation Hardening: No; Voltage: 10V; Depth: 0.5mm; Weight: 2.3E-05oz; Dielectric Material: Ceramic; Lead Free: Lead Free
C85 = CMP-CAP-00007-2: 10µF ±20% 10V Ceramic Capacitor X5R 0402 (1005 Metric); Radiation Hardening: No; Mount: Surface Mount; Voltage Rating: 10V; Contact Plating: Tin; Length: 1mm; Lead Free: Lead Free; Dielectric: X5R; Packaging: Tape and Reel; Depth: 0.5mm; Case Code (Imperial): 0402; Termination: Wraparound; Min Operating Temperature: -55°C; Package Quantity: 1; Case Code (Metric): 1005; Width: 0.02inch; Thickness: 0.028inch; Tolerance: 20%; Case/Package: 0402; Max Operating Temperature: 85°C
C86 = CMP-CAP-00053-2: 1uF ±10% 25V Ceramic Capacitor X5R 0402 (1005 Metric); Number of Terminals/Pins: 2; Multilayer: Yes; Mount: Surface Mount; Length: 1mm; Packaging: Tape and Reel; Termination: Wraparound; Min Operating Temperature: -55°C; Width: 0.5mm; Capacitor Type: Ceramic; Max Operating Temperature: 85°C; Height: 0.6mm; Dielectric Material: Ceramic; Negative Tolerance: 10%; Package Style: SMTMeter; Package Shape: Rectangular; Size Code: 0402; Rated DC Voltage (URdc): 25V; Terminal Finish: Nickel; Positive Tolerance: 10%; JESD-609 Code: e3; Temperature Characteristics Code: X5R
L5 L6 = CMP-FLT-0001-1: FERRITE BEAD 220 OHM 0603 1LN; Impedance: 220R; Number of Circuits: 1; Tolerance: 25%; Max DC Current: 1.4A; Test Frequency: 100MHz; DC Resistance (DCR): 100mR; Packaging: Tape and Reel; Length: 0.063inch; Case Code (Metric): 1608; Termination: SMD/SMT; Height: 0.037inch; Ratings: AEC-Q200; Max Operating Temperature: 125°C; Depth: 0.95mm; Lead Free: Lead Free; Current Rating: 1.4A; Mount: Surface Mount; ComponentLink1Description: Datasheet; Case/Package: 0603; Number of Lines: 1; Max Current Rating: 1.4A; Case Code (Imperial): 0603; Min Operating Temperature: -55°C; Width: 0.8mm; REACH SVHC: No SVHC; Core Material: Ferrite; ComponentLink1URL: https://www.murata.com/en-us/products/productdata/8796737273886/QNFA9101.pdf; Package Quantity: 4000
R7 R55 = CMP-RES-00002-3: as R12 on sheet Interface; Weight: 2.3E-05oz; Package Quantity: 10; Military Standard: Not; Contact Plating: Tin; Termination: SMD/SMT; Max Operating Temperature: 155°C; Case Code (Metric): 1005; Case Code (Imperial): 0402; Features: Automotive AEC-Q200; Power Rating: 63mW; REACH SVHC: Unknown; Min Operating Temperature: -55°C; Tolerance: 1%; Mount: Surface Mount; Width: 0.5mm; Depth: 0.5mm; Radiation Hardening: No; Length: 1mm; Number of Terminations: 2; Case/Package: 0402; Voltage Rating: 50V; Height: 0.35mm; Packaging: Tape and Reel; Lead Free: Lead Free; Composition: Thick Film
R69 = CMP-RES-00003-3: 100 kOhms ±1% 0.063W, 1/16W Chip Resistor 0402 (1005 Metric) Automotive AEC-Q200 Thick Film; Temperature Coefficient: 100ppm/°C; Voltage Rating (DC): 50V; Max Power Dissipation: 63mW; Number of Terminations: 2; Case/Package: 0402; Length: 1mm; Military Standard: Not; Mount: Surface Mount; Termination: SMD/SMT; Radiation Hardening: No; Package Quantity: 10000; Case Code (Metric): 1005; Case Code (Imperial): 0402; REACH SVHC: Unknown; Depth: 0.5mm; Features: Automotive AEC-Q200; Voltage Rating: 50V; Min Operating Temperature: -55°C; Lead Free: Lead Free; Power Rating: 63mW; Number of Pins: 2; Max Operating Temperature: 155°C; Contact Plating: Tin; Weight: 2.3E-05oz; Packaging: Tape and Reel; Tolerance: 1%; Height: 0.35mm; Composition: Thick Film; Width: 0.02inch
R71 R72 R79 = CMP-RES-00053-1: 0 Ohms Jumper 0.1W, 1/10W Chip Resistor 0603 (1608 Metric); Power Rating: 100mW; Temperature Coefficient: 200ppm/°C; Tolerance: 1%; Voltage Rating: 50V; Depth: 0.8mm; Military Standard: Not; Width: 0.8mm; Number of Pins: 2; Max Operating Temperature: 155°C; Composition: Thick Film; Min Operating Temperature: -55°C; Case Code (Imperial): 0603; Case Code (Metric): 1608; Packaging: Tape and Reel; Height: 0.45mm; Radiation Hardening: No; Lead Free: Lead Free; Case/Package: 0603; Package Quantity: 5000; Voltage Rating (DC): 50V; Contact Plating: Tin,Matte; Termination: SMD/SMT; Length: 1.6mm; REACH SVHC: No SVHC
TP50 TP51 TP64 TP65 = CMP-MECH-00011-2: 0.8mm round; Pins: 1
U21 U30 = CMP-PMIC-00036-2: Linear Voltage Regulator IC  1 Output  200mA 5-DSBGA (1x1.37); Regulator Type: FIXED POSITIVE SINGLE OUTPUT LDO REGULATOR; Number of Outputs: 1; Input Voltage Absolute-Max: 7V; Voltage Tolerance-Max: 2%; Max Input Voltage: 6.5V; Dropout Voltage1-Max: 175mV; Dropout Voltage1-Nom: 100mV; Qualification Status: Not Qualified; Output Voltage1-Max: 2.856V; Number of Terminals/Pins: 5; Adjustability: FIXED; Output Voltage1-Min: 2.744V; Output Voltage1-Nom: 2.8V; Min Input Voltage: 2.975V; Package Code: VFBGA; Operating Temperature, TJ-Min: -40°C; Output Current1-Max: 200mA; Technology: BICMOS; Terminal Pitch: 0.5mm; Operating Temperature, TJ-Max: 125°C; Packaging: Tape and Reel; Surface Mount: Yes; Width: 1.195mm; Package Style: GRID ARRAY, VERY THIN PROFILE, FINE PITCHMeter; Terminal Position: BOTTOM; Terminal Form: Ball; Height - Seated (Max): 0.625mm; Terminal Finish: Copper; Package Shape: Rectangular; Moisture Sensitivity Level: 1; Number of Functions: 1; Length: 1.53mm; JESD-609 Code: e1; Peak Reflow Temperature (Cel): 260°C; ComponentLink1URL: https://www.ti.com/lit/ds/sbvs056k/sbvs056k.pdf; ComponentLink1Description: Datasheet
U29 = CMP-SEN-0001-12: SENSOR CAMERA CMOS 20CAMERACUBE; Min Operating Temperature: -30°C; Number of Pins: 20; Packaging: Tape and Reel; Max Operating Temperature: 70°C; Package Quantity: 2500
U31 = CMP-PMIC-00044-1: IC PWR SWITCH P-CHAN 1:1 4DSBGA; Analog IC - Other Type: SPST; Moisture Sensitivity Level: 1; REACH SVHC: Yes; JESD-609 Code: e1; RoHS Compliant: Yes; ComponentLink1URL: https://www.ti.com/lit/ds/symlink/tps22930a.pdf?HQS=dis-dk-null-digikeymode-dsf-pf-null-wwe&ts=1618591669570; Terminal Finish: Copper; ComponentLink1Description: Datasheet; Peak Reflow Temperature (Cel): 260°C

## Sheet LCD-Memory.SchDoc
size B; DocumentNumber: 5; SheetNumber: 5; SheetTotal: 9; ENG_APP_DATE: --/--/--; DSN_APP_DATE: --/--/--; CHK_APP_DATE: --/--/--
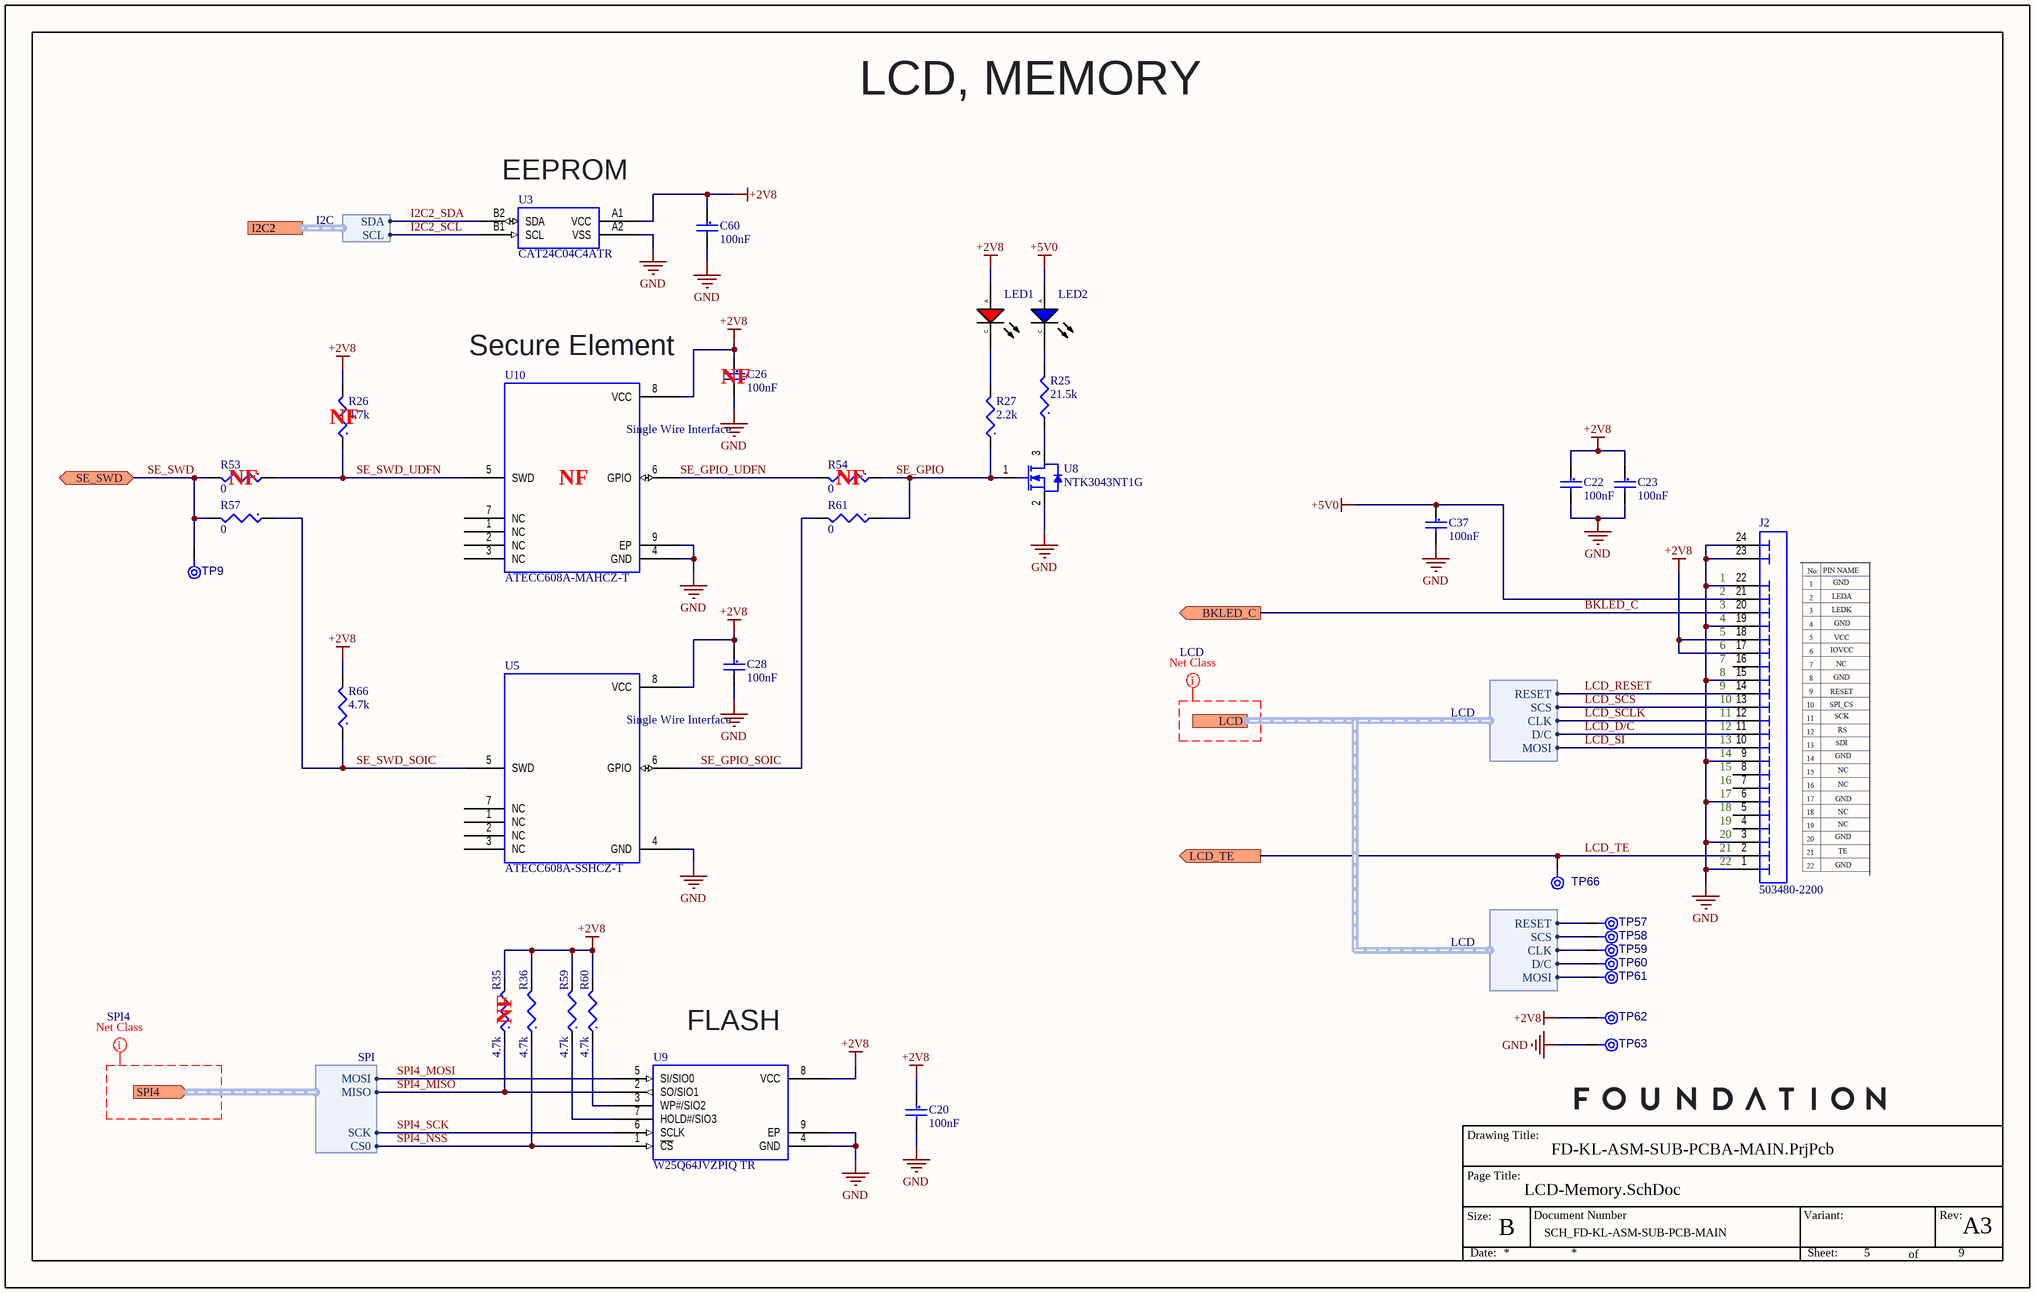
[diagram p2: LCD-Memory.SchDoc]

### Parts
C20  Capacitance: 100nF  [CAPC0402(1005)55_L]  (hidden comment: CAP CER 0.1uF 16V 10% X7R 0402)
C22  Capacitance: 100nF  [CAPC0402(1005)55_L]  (hidden comment: CAP CER 0.1uF 16V 10% X7R 0402)
C23  Capacitance: 100nF  [CAPC0402(1005)55_L]  (hidden comment: CAP CER 0.1uF 16V 10% X7R 0402)
C26  Capacitance: 100nF  [CAPC0402(1005)55_L]  (hidden comment: CAP CER 0.1uF 16V 10% X7R 0402)
C28  Capacitance: 100nF  [CAPC0402(1005)55_L]  (hidden comment: CAP CER 0.1uF 16V 10% X7R 0402)
C37  Capacitance: 100nF  [CAPC0402(1005)55_L]  (hidden comment: CAP CER 0.1uF 16V 10% X7R 0402)
C60  Capacitance: 100nF  [CAPC0402(1005)55_L]  (hidden comment: CAP CER 0.1uF 16V 10% X7R 0402)
J2  503480-2200  [MOLX - 503480-2200_V]
LED1  LTST-C191KRKT  [LEDC0603(1608)65_L]  (value not drawn)
LED2  KB DELPS2.DI-THVG-2J8L-Z555  [LEDC0603(1608)65_L]  (value not drawn)
R25  Resistance: 21.5k  [RESC0402(1005)_L]  (hidden comment: RES 21.5K 1/16W 1% 0402)
R26  Resistance: 4.7k  [RESC0402(1005)_L]  (hidden comment: RES 4.7K 1/16W 1% 0402)
R27  Resistance: 2.2k  [RESC0402(1005)_L]  (hidden comment: RES 2.2K 1/16W 1% 0402)
R35  Resistance: 4.7k  [RESC0402(1005)_L]  (hidden comment: RES 4.7K 1/16W 1% 0402)
R36  Resistance: 4.7k  [RESC0402(1005)_L]  (hidden comment: RES 4.7K 1/16W 1% 0402)
R53  Resistance: 0  [RESC0402(1005)_L]  (hidden comment: RES 0 OHM JUMPER 1/16W 0402)
R54  Resistance: 0  [RESC0402(1005)_L]  (hidden comment: RES 0 OHM JUMPER 1/16W 0402)
R57  Resistance: 0  [RESC0402(1005)_L]  (hidden comment: RES 0 OHM JUMPER 1/16W 0402)
R59  Resistance: 4.7k  [RESC0402(1005)_L]  (hidden comment: RES 4.7K 1/16W 1% 0402)
R60  Resistance: 4.7k  [RESC0402(1005)_L]  (hidden comment: RES 4.7K 1/16W 1% 0402)
R61  Resistance: 0  [RESC0402(1005)_L]  (hidden comment: RES 0 OHM JUMPER 1/16W 0402)
R66  Resistance: 4.7k  [RESC0402(1005)_L]  (hidden comment: RES 4.7K 1/16W 1% 0402)
TP9  TPAD8R  [TP08R]  (value not drawn)  (no BOM)
TP57  TPAD8R  [TP08R]  (value not drawn)  (no BOM)
TP58  TPAD8R  [TP08R]  (value not drawn)  (no BOM)
TP59  TPAD8R  [TP08R]  (value not drawn)  (no BOM)
TP60  TPAD8R  [TP08R]  (value not drawn)  (no BOM)
TP61  TPAD8R  [TP08R]  (value not drawn)  (no BOM)
TP62  TPAD8R  [TP08R]  (value not drawn)  (no BOM)
TP63  TPAD8R  [TP08R]  (value not drawn)  (no BOM)
TP66  TPAD8R  [TP08R]  (value not drawn)  (no BOM)
U3  CAT24C04C4ATR  [ON - WLCSP-4_V]
U5  ATECC608A-SSHCZ-T  [MCHP - SOIC-8_L]
U8  NTK3043NT1G  [SOT-723-3(40)_N]
U9  W25Q64JVZPIQ TR  [MXIC - WSON-8_L]
U10  ATECC608A-MAHCZ-T  [MCHP - UDFN-8_L]

### Ports
BKLED_C (out), I2C2 (harness I2C), LCD (harness LCD), LCD_TE (out), SE_SWD (bidir), SPI4 (in, harness SPI)

### Harnesses
LCD: CLK, SCS, MOSI, D/C, RESET
SPI: CS0, MISO, MOSI, SCK
I2C: SCL, SDA

### Nets
+2V8: C20.1 C22.1 C23.1 C26.1 C28.1 C60.1 J2.17 J2.18 LED1.A R26.2 R35.2 R36.2 R59.2 R60.2 R66.2 TP62.1(TP) U3.A1(VCC) U5.8(VCC) U9.8(VCC) U10.8(VCC)
+5V0: C37.1 J2.21 LED2.A
GND: C20.2 C22.2 C23.2 C26.2 C28.2 C37.2 C60.2 J2.1 J2.3 J2.6 J2.9 J2.15 J2.19 J2.22 J2.23 J2.24 TP63.1(TP) U3.A2(VSS) U5.4(GND) U8.2(S) U9.4(GND) U9.9(EP) U10.4(GND) U10.9(EP)
BKLED_C: J2.20 ; port BKLED_C
I2C2_SCL: U3.B1(SCL) ; port I2C2.SCL
I2C2_SDA: U3.B2(SDA) ; port I2C2.SDA
LCD_D/C: J2.11 TP60.1(TP) ; port LCD.D/C
LCD_RESET: J2.14 TP57.1(TP) ; port LCD.RESET
LCD_SCLK: J2.12 TP59.1(TP) ; port LCD.CLK
LCD_SCS: J2.13 TP58.1(TP) ; port LCD.SCS
LCD_SI: J2.10 TP61.1(TP) ; port LCD.MOSI
LCD_TE: J2.2 TP66.1(TP) ; port LCD_TE
SE_GPIO: R27.1 R54.1 R61.1 U8.1(G)
SE_GPIO_SOIC: R61.2 U5.6(GPIO)
SE_GPIO_UDFN: R54.2 U10.6(GPIO)
SE_SWD: R53.2 R57.2 TP9.1(TP) ; port SE_SWD
SE_SWD_SOIC: R57.1 R66.1 U5.5(SWD)
SE_SWD_UDFN: R26.1 R53.1 U10.5(SWD)
SPI4_MISO: R35.1 U9.2(SO/SIO1) ; port SPI4.MISO
SPI4_MOSI: U9.5(SI/SIO0) ; port SPI4.MOSI
SPI4_NSS: R36.1 U9.1(~{CS}) ; port SPI4.CS0
SPI4_SCK: U9.6(SCLK) ; port SPI4.SCK
NetLED1_C: LED1.C R27.2
NetLED2_C: LED2.C R25.2
NetR25_1: R25.1 U8.3(D)
NetR59_1: R59.1 U9.7(HOLD#/SIO3)
NetR60_1: R60.1 U9.3(WP#/SIO2)

Not connected (* = marked no-connect by the designer): J2 4 5 7 8 16; U5 1(NC) 2(NC) 3(NC) 7(NC); U10 1(NC) 2(NC) 3(NC) 7(NC)

### Layout directives
net class LCD: (no net found under the mark)
net class SPI4: (no net found under the mark)

### Notes on the sheet
- LCD, MEMORY
- (near U3) EEPROM
- (near U10) Secure Element
- (near J2) 1
- (near J2) 2
- (near J2) 3
- (near J2) 4
- (near J2) 5
- (near J2) 6
- (near J2) 7
- (near J2) 8
- (near J2) 9
- (near J2) 10
- (near J2) 11
- (near J2) 12
- (near J2) 13
- (near J2) 14
- (near J2) 15
- (near J2) 16
- (near J2) 17
- (near J2) 18
- (near J2) 19
- (near J2) 20
- (near J2) 21
- (near J2) 22
- (near U9) FLASH
- Drawing Title:
- Page Title:
- Size:
- B
- Document Number
- Variant:
- Rev:
- Date:
- Sheet:
- of
- (in symbol CMP-IC-MEM-0002-7) Single Wire Interface
- (in symbol CMP-IC-MEM-0020-1) Single Wire Interface

### Library data of the parts
C20 C22 C23 C26 C28 C37 C60 = CMP-CAP-00002-2: as C14 on sheet Interface; Material: Ceramic; Tolerance: 10%; REACH SVHC: No SVHC; Radiation Hardening: No; Case Code (Metric): 1005; Height: 0.5mm; Depth: 0.5mm; Min Operating Temperature: -55°C; Max Operating Temperature: 125°C; Lead Free: Lead Free; Thickness: 0.022inch; Length: 1mm; Voltage Rating (DC): 16V; Dielectric Material: Ceramic; Packaging: Tape and Reel; Case/Package: 0402; Width: 0.5mm; Termination: SMD/SMT; Voltage Rating: 16V; Mount: Surface Mount; Case Code (Imperial): 0402; Package Quantity: 1; Dielectric: X7R; Number of Pins: 2; Voltage: 16V
J2 = CMP-CON-0074-1: 22 Position FFC, FPC Connector Contacts, Top and Bottom 0.020" (0.50mm) Surface Mount, Right Angle; Body Length: 0.5inch; Plating Thickness: 39uin; Number of Rows Loaded: 1; Body Depth: 0.142inch; Contact Pattern: RECTANGULAR; Number of Contacts: 22; Reliability: COMMERCIAL; Body Breadth: 0.039inch; Connector Type: CARD EDGE CONNECTOR; Rated Current (Signal): 500mA; Mounting Option 1: LOCKING; Contact Style: BELLOWED TYPE; Mating Contact Pitch: 0.02inch; Insulation Color: White; Mounting Style: RIGHT ANGLE; Termination: SMD/SMT; Contact Finish - Mating: NOT SPECIFIED; REACH SVHC: Yes; Terminal Pitch: 0.508mm; Min Operating Temperature: -40°C; PCB Contact Pattern: RECTANGULAR; RoHS Compliant: Yes; Max Operating Temperature: 85°C; Number Of PCB Rows: 1; Insulation Material: Polymer; Mount: Board
LED1 = CMP-007-00039-8: Red 631nm LED Indication - Discrete 2V 0603 (1608 Metric); Viewing Angle: 130°; Test Current: 20mA; Number of LEDs: 1; Reverse Voltage: 5V; Power Rating: 75mW; Luminous Intensity: 54mcd; Lens Color: Colorless; Lens Style: Clear,Diffused,Colorless,Rectangular; Lens Transparency: Clear; Wavelength: 639nm; Forward Current: 30mA; Case/Package: 0603; Lead Free: Lead Free; Dominant Wavelength: 631nm; Forward Voltage: 2V; Depth: 0.8mm; Length: 1.6mm; Height: 0.55mm; Power Dissipation: 75mW; Voltage: 2V; Width: 0.8mm; Mount: Surface Mount; Illumination Color: Red; Case Code (Metric): 1608; Case Code (Imperial): 0603; Number of Pins: 2; Packaging: Tape and Reel; Max Operating Temperature: 85°C; Min Operating Temperature: -55°C; Radiation Hardening: No; Color: Red; Package Quantity: 1; Number of Elements: 1
LED2 = CMP-007-00045-4: Blue 466nm LED Indication - Discrete 2.8V 2-SMD 0603
R25 = CMP-RES-00073-1: 21.5 kOhms ±1% 0.063W, 1/16W Chip Resistor 0402 (1005 Metric); Voltage Rating: 50V; Temperature Coefficient: 100ppm/°C; Number of Terminals/Pins: 2; Reference Standard: AEC-Q200; Rated Temperature: 70°C; Package Height: 0.35mm; Rated Power Dissipation (P): 63mW; Package Width: 0.5mm; Package Length: 1mm; Max Operating Temperature: 155°C; Min Operating Temperature: -55°C; Tolerance: 1%; Termination: Wraparound; Packaging: Tape and Reel; Mount: Surface Mount; Working Voltage: 50V; Construction: Chip; Resistor Type: FIXED RESISTOR; Technology: METAL GLAZE/THICK FILM; JESD-609 Code: e3; Size Code: 0402; Terminal Finish: Nickel; Package Style: SMTMeter; Package Shape: Rectangular
R26 R35 R36 R59 R60 R66 = CMP-RES-00002-3: as R12 on sheet Interface; Weight: 2.3E-05oz; Package Quantity: 10; Military Standard: Not; Contact Plating: Tin; Termination: SMD/SMT; Max Operating Temperature: 155°C; Case Code (Metric): 1005; Case Code (Imperial): 0402; Features: Automotive AEC-Q200; Power Rating: 63mW; REACH SVHC: Unknown; Min Operating Temperature: -55°C; Tolerance: 1%; Mount: Surface Mount; Width: 0.5mm; Depth: 0.5mm; Radiation Hardening: No; Length: 1mm; Number of Terminations: 2; Case/Package: 0402; Voltage Rating: 50V; Height: 0.35mm; Packaging: Tape and Reel; Lead Free: Lead Free; Composition: Thick Film
R27 = CMP-RES-00049-1: 2.2 kOhms ±1% 0.063W, 1/16W Chip Resistor 0402 (1005 Metric); Temperature Coefficient: 100ppm/°C; Voltage Rating: 50V; Power Rating: 63mW; Termination: SMD/SMT; Max Operating Temperature: 155°C; Height: 0.35mm; Length: 1mm; Case Code (Metric): 1005; REACH SVHC: Unknown; Case/Package: 0402; Weight: 2.3E-05oz; Composition: Thick Film; Min Operating Temperature: -55°C; Width: 0.5mm; Military Standard: Not; Case Code (Imperial): 0402; Depth: 0.5mm; Packaging: Tape and Reel; Lead Free: Lead Free; Tolerance: 1%
R53 R54 R57 R61 = CMP-RES-00014-4: 0 Ohms Jumper 0.063W, 1/16W Chip Resistor 0402 (1005 Metric); Temperature Coefficient: 200ppm/°C; Power Rating: 62.5mW; Max Power Dissipation: 63mW; Tolerance: 5%; Voltage Rating: 50V; Lead Free: Lead Free; Height: 0.016inch; Military Standard: Not; Max Operating Temperature: 155°C; Features: Moisture Resistant; Case/Package: 0402; Contact Plating: Tin,Matte; Composition: Thick Film; Number of Terminations: 2; Case Code (Imperial): 0402; Package Quantity: 1; REACH SVHC: Unknown; Radiation Hardening: No; Case Code (Metric): 1005; Width: 0.02inch; Termination: SMD/SMT; Min Operating Temperature: -55°C; Length: 1mm; Packaging: Tape and Reel; Depth: 0.5mm
TP9 TP57-TP63 TP66 = CMP-MECH-00011-2: 0.8mm round; Pins: 1
U3 = CMP-IC-MEM-0006-1: EEPROM Memory IC 4Kb (512 x 8) I²C 400kHz 900ns 4-WLCSP (0.84x0.86); Max Supply Voltage: 5.5V; Interface: I2C,Serial,2-Wire; Min Supply Voltage: 1.7V; Nominal Supply Current: 2mA; ComponentLink1Description: Datasheet; Max Operating Temperature: 85°C; Package Quantity: 5000; Mount: Surface Mount; Lead Free: Lead Free; Memory Size: 4KB; Density: 4Kb; Max Frequency: 400kHz; Radiation Hardening: No; Halogen Free: Halogen Free; Packaging: Tape and Reel; Number of Pins: 4; Memory Type: EEPROM; Frequency: 400kHz; Min Operating Temperature: -40°C; ComponentLink1URL: https://www.onsemi.com/pub/Collateral/CAT24C01-D.PDF; Access Time: 900ns
U5 = CMP-IC-MEM-0020-1: Cryptographic Co-Processor with Secure Hardware-Based Key Storage 1-Wire Interface 8-Pin SOIC T/R; Supply Voltage-Max (Vsup): 5.5V; Package Body Material: Plastic; Number of Functions: 1; Consumer IC Type: CONSUMER CIRCUIT; Number of Terminals/Pins: 8; Supply Voltage-Min (Vsup): 2V; Width: 3.9mm; Length: 4.9mm; JESD-30 Code: R-PDSO-G8; Temperature Grade: INDUSTRIAL; Terminal Form: Gull Wing; Case/Package: 8-UDFN (2x3); Height - Seated (Max): 1.75mm; Package Shape: Rectangular; Surface Mount: Yes; Package Style: SMALL OUTLINEMeter; Package Code: SOP; RoHS Compliant: No; REACH SVHC: Yes; Terminal Pitch: 1.27mm; Min Operating Temperature: -40°C; Technology: CMOS; Max Operating Temperature: 85°C; Terminal Position: DUAL
U8 = CMP-TRNST-0003-1: as U26 on sheet Interface; Max Operating Temperature: 150°C; Package Quantity: 1; Packaging: Tape and Reel; Continuous Drain Current (ID): 210mA; Pins: 3; Min Operating Temperature: -55°C; Vgs (Max): 10V; Drain to Source Breakdown Voltage: 20V; Radiation Hardening: No; Mounting Technology: Surface Mount; Drain to Source Voltage (Vdss): 20V; Number of Pins: 3; Max Power Dissipation: 310mW; Fall Time: 15ns; Case/Package: SOT-723-3; Transistor Type: N-Channel; Rds On Max: 3.4R; Lead Free: Lead Free; Height: 0.55mm; Contact Plating: Tin,Matte; On-State Resistance: 3.4R; Length: 1.25mm; REACH SVHC: No SVHC; Width: 0.85mm; Voltage Rating (DC): 20V
U9 = CMP-IC-MEM-0023-1: FLASH - NOR Memory IC 64Mb (8M x 8) SPI - Quad I/O 133 MHz 8-WSON (6x5); ComponentLink1Description: Datasheet; ComponentLink1URL: https://www.winbond.com/resource-files/w25q64jv%20revj%2003272018%20plus.pdf
U10 = CMP-IC-MEM-0002-7: Cryptographic Co-Processor with Secure Hardware-Based Key Storage 1-Wire Interface 8-Pin UDFN T/R; Case/Package: 8-UDFN (2x3)